# EAGLE design try (EAGLE 9.5.2)
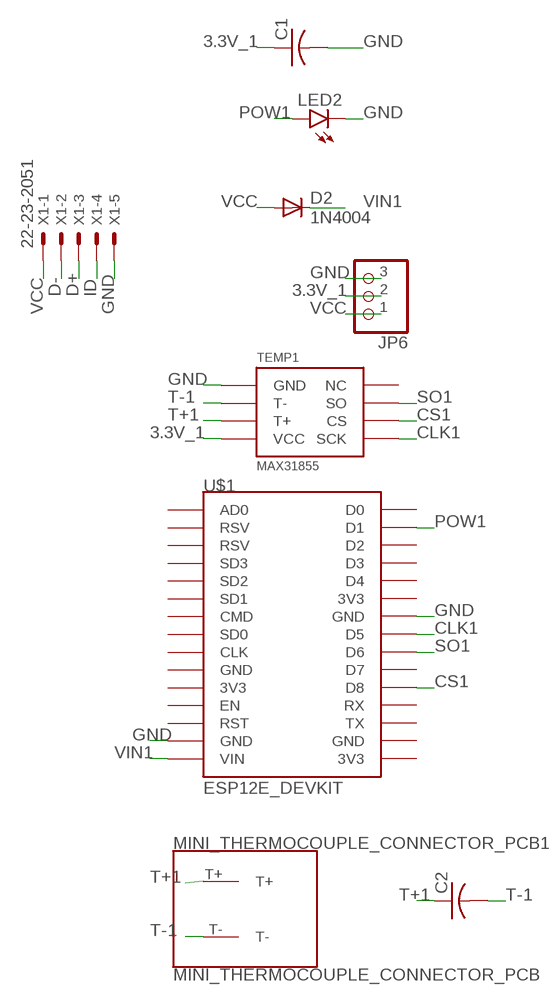
[diagram p0: schematic, sheet 1]

## Parts
C1  C-US025-040X050  [C025-040X050]
C2  C-US025-040X050  [C025-040X050]
D2  1N4004  [DO41-10]
JP6  PINHD-1X3CB  [1X03-CLEANBIG]
LED2  LED5MM  [LED5MM]
MINI_THERMOCOUPLE_CONNECTOR_PCB1  MINI_THERMOCOUPLE_CONNECTOR_PCB  [MINI_THERMOCOUPLE_CONNECTOR_PCB]
TEMP1  MAX31855  MAX6675MAX31855  [SOIC-8]
U$1  ESP12E_DEVKIT  [ESP12E_DEVKIT]
X1  22-23-2051  [22-23-2051]

## Nets
3.3V_1: C1.1 JP6.2 TEMP1.VCC
CLK1: TEMP1.SCK U$1.D5
CS1: TEMP1.CS U$1.D8
D+: X1.3
D-: X1.2
GND: C1.2 JP6.3 LED2.K(C) TEMP1.GND U$1.GND@1(GND) U$1.GND@2(GND) X1.5
ID: X1.4
POW1: LED2.A U$1.D1
SO1: TEMP1.SO U$1.D6
T+1: C2.1 MINI_THERMOCOUPLE_CONNECTOR_PCB1.T+ TEMP1.T+
T-1: C2.2 MINI_THERMOCOUPLE_CONNECTOR_PCB1.T- TEMP1.T-
VCC: D2.A JP6.1 X1.1
VIN1: D2.C U$1.VIN
Unconnected: TEMP1.NC U$1.3V3@0(3V3) U$1.3V3@1(3V3) U$1.3V3@2(3V3) U$1.AD0 U$1.CLK U$1.CMD U$1.D0 U$1.D2 U$1.D3 U$1.D4 U$1.D7 U$1.EN U$1.GND@0(GND) U$1.GND@3(GND) U$1.RST U$1.RSV@0(RSV) U$1.RSV@1(RSV) U$1.RX U$1.SD0 U$1.SD1 U$1.SD2 U$1.SD3 U$1.TX

## Library data of the parts
C1 C2 = adafruit:C-US: CAPACITOR, American symbol
D2 = adafruit:1N4004: DIODE General purpose 1N400x type rectifier (With bigger pads) http://www.ladyada.net/library/pcb/eaglelibrary.html
JP6 = adafruit:PINHD-1X3: PIN HEADER
LED2 = led:LED: LED OSRAM: - CHIPLED LG R971, LG N971, LY N971, LG Q971, LY Q971, LO R971, LY R971 LH N974, LH R974 LS Q976, LO Q976, LY Q976 LO Q996 - Hyper CHIPLED LW Q18S LB Q993, LB Q99A, LB R99A - SideLED LS A670, LO A670, LY A670, LG A670, LP A670 LB A673, LV A673, LT A673, LW A673 LH A674 LY A675 LS A676, LA A676, LO A676, LY A676, LW A676 LS A679, LY A679, LG A679 - Hyper Micro SIDELED® LS Y876, LA Y876, LO Y876, LY Y876 LT Y87S - SmartLED LW L88C, LW L88S LB L89C, LB L89S, LG L890 LS L89K, LO L89K, LY L89K LS L896, LA L896, LO L896, LY L896 - TOPLED LS T670, LO T670, LY T670, LG T670, LP T670 LSG T670, LSP T670, LSY T670, LOP T670, LYG T670 LG T671, LOG T671, LSG T671 LB T673, LV T673, LT T673, LW T673 LH T674 LS T676, LA T676, LO T676, LY T676, LB T676, LH T676, LSB T676, LW T676 LB T67C, LV T67C, LT T67C, LS T67K, LO T67K, LY T67K, LW E67C LS E67B, LA E67B, LO E67B, LY E67B, LB E67C, LV E67C, LT E67C LW T67C LS T679, LY T679, LG T679 LS T770, LO T770, LY T770, LG T770, LP T770 LB T773, LV T773, LT T773, LW T773 LH T774 LS E675, LA E675, LY E675, LS T675 LS T776, LA T776, LO T776, LY T776, LB T776 LHGB T686 LT T68C, LB T68C - Hyper Mini TOPLED® LB M676 - Mini TOPLED Santana® LG M470 LS M47K, LO M47K, LY M47K Source: http://www.osram.convergy.de LUXEON: - LUMILED® LXK2-PW12-R00, LXK2-PW12-S00, LXK2-PW14-U00, LXK2-PW14-V00 LXK2-PM12-R00, LXK2-PM12-S00, LXK2-PM14-U00 LXK2-PE12-Q00, LXK2-PE12-R00, LXK2-PE12-S00, LXK2-PE14-T00, LXK2-PE14-U00 LXK2-PB12-K00, LXK2-PB12-L00, LXK2-PB12-M00, LXK2-PB14-N00, LXK2-PB14-P00, LXK2-PB14-Q00 LXK2-PR12-L00, LXK2-PR12-M00, LXK2-PR14-Q00, LXK2-PR14-R00 LXK2-PD12-Q00, LXK2-PD12-R00, LXK2-PD12-S00 LXK2-PH12-R00, LXK2-PH12-S00 LXK2-PL12-P00, LXK2-PL12-Q00, LXK2-PL12-R00 Source: www.luxeon.com KINGBRIGHT: KA-3528ASYC Source: www.kingbright.com
MINI_THERMOCOUPLE_CONNECTOR_PCB1 = Mini_Thermocouple_Connector_PCB:MINI_THERMOCOUPLE_CONNECTOR_PCB
TEMP1 = McLEng:MAX6675
U$1 = ESP12E_DEVKIT:ESP12E_DEVKIT: ESP12E DEVKIT BOARD
X1 = con-molex:22-23-2051: .100" (2.54mm) Center Header - 5 Pin; MF: MOLEX; MPN: 22-23-2051; OC_FARNELL: 1462952; OC_NEWARK: 38C9178

## Board
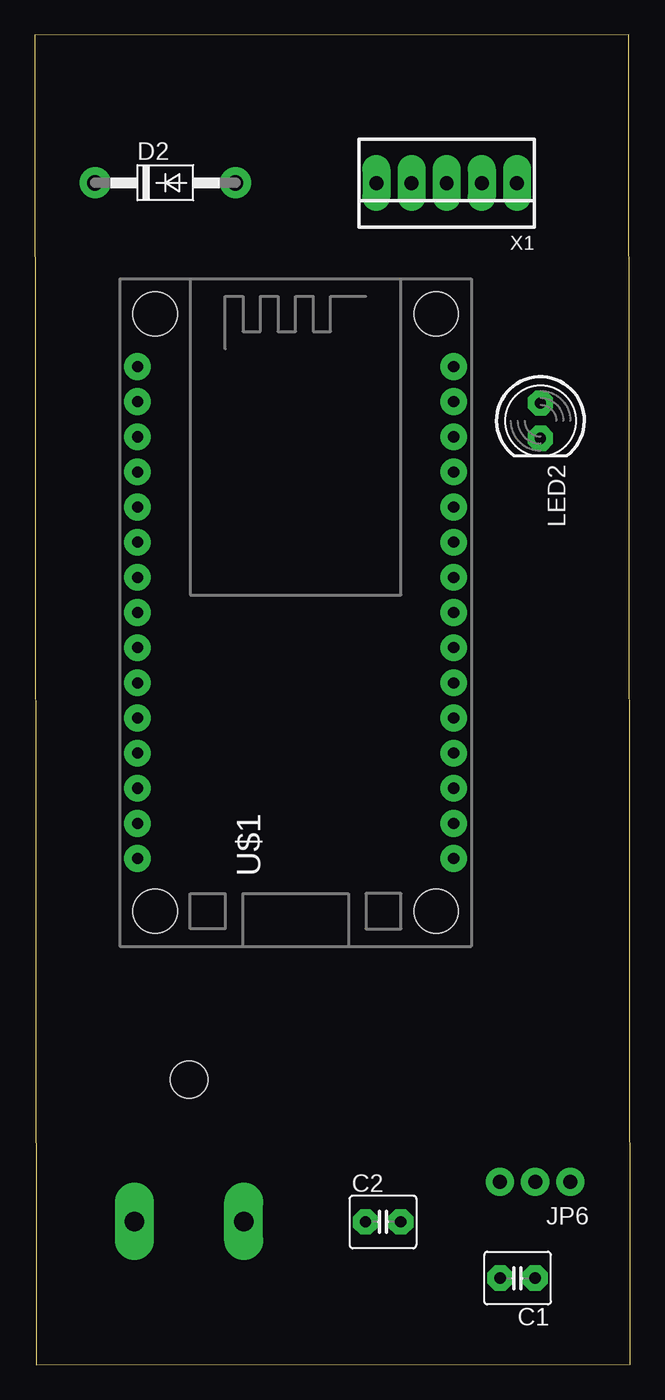
[diagram p1: board, top side]
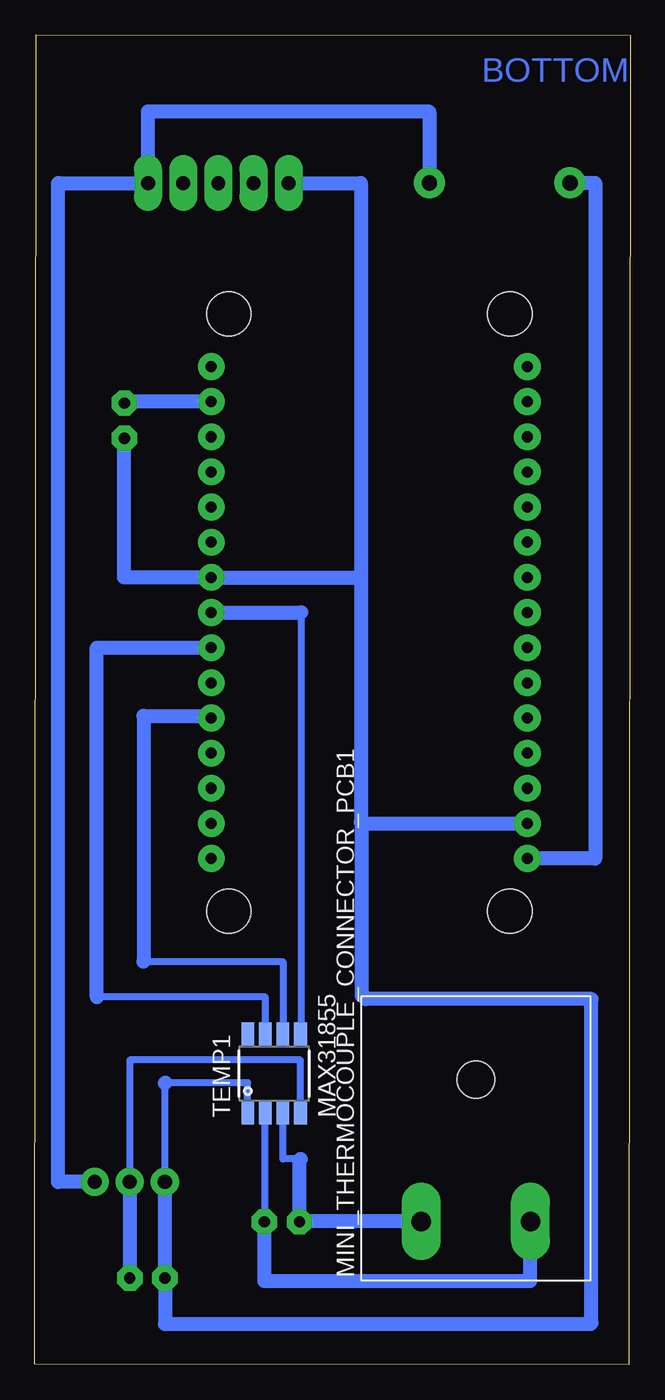
[diagram p2: board, bottom side, seen from below]

Size 43.08 x 96.15 mm. Coordinates in mm from the lower left corner, seen from the top.
Outline: 0.1,0 43.08,0.05 42.98,96.15 0,96.1 0.1,0
Copper layers (1*16): Top 0.035mm / dielectric 1.5mm / Bottom 0.035mm
Design rules "Old *": minimum track width 1mm, minimum drill 1mm, track to track 16mil, track to pad 8mil, pad to pad 8mil, via to via 16mil, smd to smd 6mil, copper to edge 30mil, drill to drill 6mil, minimum pad ring 20mil, minimum via ring 8mil, stop-mask expansion 4mil, vias tented up to drill 0mil, thermal gap 10mil

### Footprints (pad centres in the part's own frame; a part is rotated, then mirrored left to right if it is on the bottom)
C025-040X050 = drill 0.813 pad 1.422 octagon: 1 -1.27,0; 2 1.27,0
DO41-10 = drill 1.118 pad 1.93: A 5.08,0; C -5.08,0
1X03-CLEANBIG = drill 1.016 pad 1.676: 1 -2.54,0; 2 0,0; 3 2.54,0
LED5MM = drill 0.813 octagon: A -1.27,0; K 1.27,0
MINI_THERMOCOUPLE_CONNECTOR_PCB = drill 1.4 long: T+ 4.25,12.25; T- 4.25,4.35 | hole 2.7: 14.5,8.3
SOIC-8 = smd 1.778 x 0.914: CS 2.794,-0.635; GND -2.794,1.905; NC 2.794,1.905; SCK 2.794,-1.905; SO 2.794,0.635; T+ -2.794,-0.635; T- -2.794,0.635; VCC -2.794,-1.905
ESP12E_DEVKIT = drill 0.8 pad 1.93: 3V3@0 -11.43,-7.62; 3V3@1 11.43,5.08; 3V3@2 11.43,-17.78; AD0 -11.43,17.78; CLK -11.43,-2.54; CMD -11.43,2.54; D0 11.43,17.78; D1 11.43,15.24; D2 11.43,12.7; D3 11.43,10.16; D4 11.43,7.62; D5 11.43,0; D6 11.43,-2.54; D7 11.43,-5.08; D8 11.43,-7.62; EN -11.43,-10.16; GND@0 -11.43,-5.08; GND@1 -11.43,-15.24; GND@2 11.43,2.54; GND@3 11.43,-15.24; RST -11.43,-12.7; RSV@0 -11.43,15.24; RSV@1 -11.43,12.7; RX 11.43,-10.16; SD0 -11.43,0; SD1 -11.43,5.08; SD2 -11.43,7.62; SD3 -11.43,10.16; TX 11.43,-12.7; VIN -11.43,-17.78 | hole 3.2: -10.16,21.59; 10.16,21.59; 10.16,-21.59; -10.16,-21.59
22-23-2051 = drill 1 long: 1 -5.08,0; 2 -2.54,0; 3 0,0; 4 2.54,0; 5 5.08,0

### Placement (x,y rotation side)
C1  34.93,6.27 180 top
C2  25.2,10.34 0 top
D2  9.45,85.45 0 top
JP6  36.2,13.23 180 top
LED2  36.58,68.25 270 top
MINI_THERMOCOUPLE_CONNECTOR_PCB1  2.87,6.12 90 bottom
TEMP1  25.76,21.06 90 bottom
U$1  18.87,54.38 0 top
X1  29.79,85.42 180 top

### Tracks (layer width: path | path; a pad name or v marks a point on that pad's centre or on a via)
3.3V_1
  Bottom 0.5: TEMP1.VCC 23.85,22.05 36.2,22.05 JP6.2
  Bottom 1: JP6.2 C1.1
CLK1
  Bottom 0.5: TEMP1.SCK 23.8,23.9 23.8,54.38
  Bottom 1: U$1.D5 23.8,54.38
CS1
  Bottom 0.5: 35.2,29.16 25.12,29.16 TEMP1.CS
  Bottom 1: U$1.D8 30.45,46.91 35.2,46.91 35.2,29.16
GND
  Bottom 0.5: TEMP1.GND 27.66,20.4 33.63,20.4 | JP6.3 33.66,20.37
  Bottom 1: X1.5 19.48,85.42 19.48,56.95 | 19.48,56.95 19.48,39.22 19.41,39.14 | 19.41,39.14 U$1.GND@1 | 19.48,56.95 19.51,56.92 U$1.GND@2 36.6,56.92 36.6,66.95 LED2.K | 33.66,20.37 33.63,20.4 | JP6.3 C1.2 33.66,2.97 2.87,2.97 2.82,3.02 2.82,26.44 19.15,26.44 19.41,26.7 19.41,39.14
POW1
  Bottom 1: U$1.D1 36.47,69.62 LED2.A
SO1
  Bottom 0.5: TEMP1.SO 26.39,26.59 38.58,26.59
  Bottom 1: U$1.D6 38.58,51.84 38.58,26.59
T+1
  Bottom 0.5: TEMP1.T+ 25.12,14.88 23.85,14.88
  Bottom 1: 23.85,14.88 23.84,14.88 23.93,14.79 C2.1 23.89,10.37 MINI_THERMOCOUPLE_CONNECTOR_PCB1.T+
T-1
  Bottom 0.5: C2.2 26.47,18.19 TEMP1.T-
  Bottom 1: MINI_THERMOCOUPLE_CONNECTOR_PCB1.T- 7.26,10.33 7.26,6.05 26.47,6.05 C2.2
VCC
  Bottom 1: D2.A 14.53,90.55 14.58,90.6 34.87,90.6 X1.1 41.35,85.42 41.38,85.39 41.38,13.21 41.35,13.23 JP6.1
VIN1
  Bottom 1: D2.C 2.54,85.45 2.54,36.6 U$1.VIN

### Text on the board
Bottom: BOTTOM